# Altium project Smart_Garden.PrjPCB
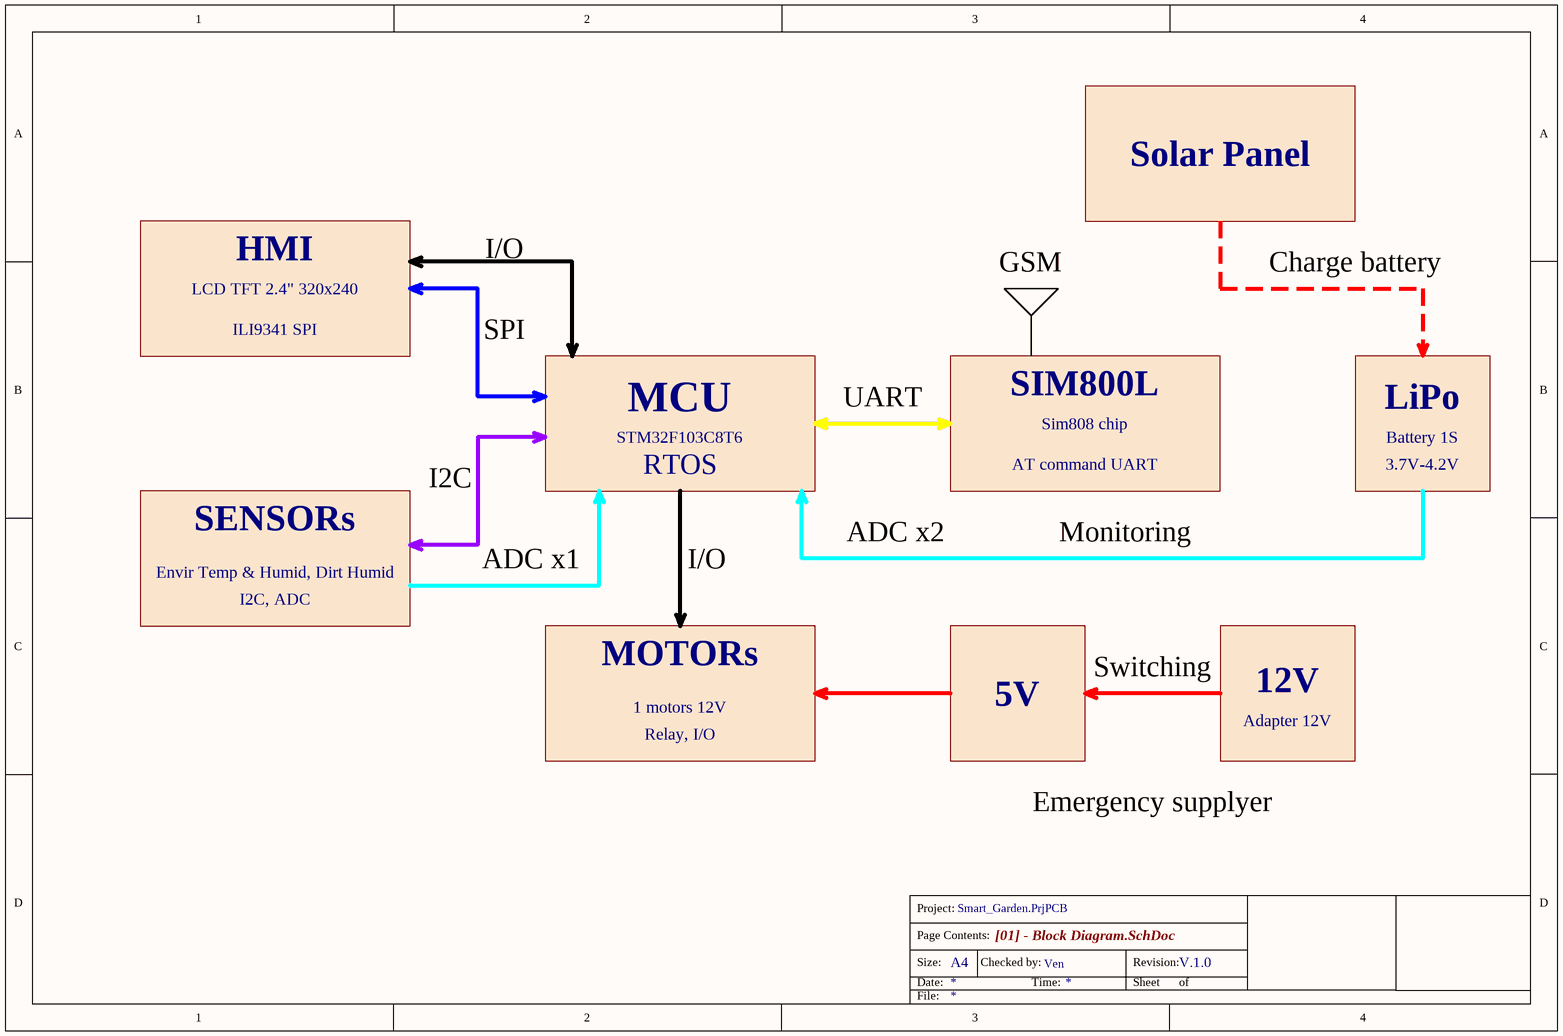
[diagram p0: [01] - Block Diagram.SchDoc]
9 sheets, 81 parts. Net scope: hierarchical (ports join the sheet entries above them; power ports are global).
Board files: Smart_Garden.PcbDoc, LOGO.PcbDoc
Sheets:
  [01] - Block Diagram.SchDoc
  [02] - Sheet Connector.SchDoc
    01 = [03] - MCU.SchDoc
    02 = [04] - SIM808.SchDoc
    04 = [06] - Sensor.SchDoc
    03 = [05] - HMI.SchDoc
    06 = [08] - Solar.SchDoc
    07 = [09] - Power.SchDoc
    05 = [07] - Motor.SchDoc

## Sheet [01] - Block Diagram.SchDoc: =ProjectName
size A4; CheckedBy: Ven; Author: Ven; CompanyName: HUST; Revision: V.1.0

### Notes on the sheet
- Solar Panel
- HMI
- I/O
- LCD TFT 2.4" 320x240
- GSM
- Charge battery
- ILI9341 SPI
- SPI
- SIM800L
- MCU
- STM32F103C8T6
- UART
- Sim808 chip
- LiPo
- Battery 1S
- SENSORs
- I2C
- RTOS
- AT command UART
- 3.7V-4.2V
- Envir Temp & Humid, Dirt Humid
- ADC x1
- ADC x2
- Monitoring
- I2C, ADC
- MOTORs
- 1 motors 12V
- 5V
- Switching
- 12V
- Adapter 12V
- Relay, I/O
- Emergency supplyer
- Project:
- Page Contents:
- Size:
- Date:
- A4
- Checked by:
- Time:
- Revision:
- Sheet
- of
- File:

## Sheet [02] - Sheet Connector.SchDoc: =ProjectName
size A4; CheckedBy: Ven; Author: Ven; CompanyName: HUST; Revision: V.1.0
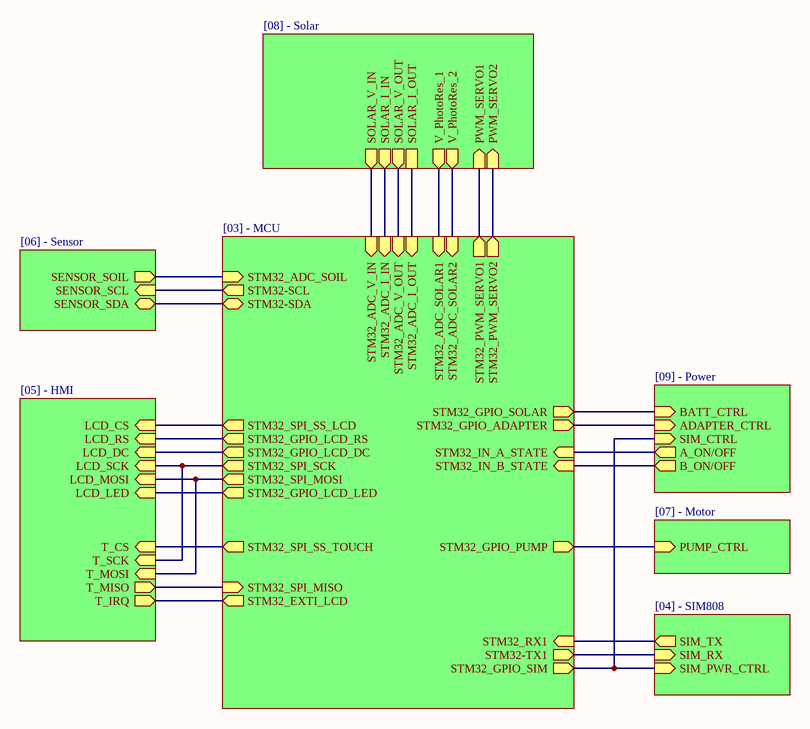
[diagram p1: [02] - Sheet Connector.SchDoc]

### Sub-sheets
01 = [03] - MCU: STM32-SDA (bidir), STM32_GPIO_SOLAR (out), STM32_SPI_MISO (in), STM32_EXTI_LCD (out), STM32_ADC_SOLAR1 (in), STM32_ADC_SOIL (in), STM32_GPIO_LCD_LED (out), STM32_SPI_SS_TOUCH (out), STM32_IN_B_STATE (in), STM32_ADC_I_IN (in), STM32_GPIO_PUMP (out), STM32_ADC_V_IN (in), STM32_ADC_SOLAR2 (in), STM32_GPIO_LCD_RS (out), STM32-TX1 (out), STM32_GPIO_LCD_DC (out), STM32_GPIO_ADAPTER (out), STM32_ADC_I_OUT (in), STM32_SPI_SS_LCD (out), STM32_RX1 (in), STM32_IN_A_STATE (in), STM32_SPI_MOSI (out), STM32_SPI_SCK (out), STM32-SCL (out), STM32_ADC_V_OUT (in), STM32_PWM_SERVO2 (out), STM32_PWM_SERVO1 (out), STM32_GPIO_SIM (out)
02 = [04] - SIM808: SIM_TX (out), SIM_RX (in), SIM_PWR_CTRL (in)
03 = [05] - HMI: T_SCK (in), LCD_MOSI (in), LCD_DC (in), T_MOSI (in), T_IRQ (out), T_MISO (out), LCD_LED (in), LCD_SCK (in), LCD_CS (in), T_CS (in), LCD_RS (in)
04 = [06] - Sensor: SENSOR_SCL (in), SENSOR_SDA (bidir), SENSOR_SOIL (out)
05 = [07] - Motor: PUMP_CTRL (in)
06 = [08] - Solar: SOLAR_V_OUT (out), SOLAR_I_OUT, SOLAR_V_IN (out), SOLAR_I_IN (out), PWM_SERVO2 (in), PWM_SERVO1 (in), V_PhotoRes_1 (out), V_PhotoRes_2 (out)
07 = [09] - Power: A_ON/OFF (out), BATT_CTRL (in), SIM_CTRL (in), ADAPTER_CTRL (in), B_ON/OFF (out)

### Nets
5V-1: sheet 01/STM32_IN_A_STATE, sheet 07/A_ON/OFF
CTRL: sheet 01/STM32_GPIO_SIM, sheet 02/SIM_PWR_CTRL, sheet 07/SIM_CTRL
RX1: sheet 01/STM32_RX1, sheet 02/SIM_TX
SCL: sheet 01/STM32-SCL, sheet 04/SENSOR_SCL
SDA: sheet 01/STM32-SDA, sheet 04/SENSOR_SDA
TX1: sheet 01/STM32-TX1, sheet 02/SIM_RX
NetIC2_7: sheet 01/STM32_ADC_I_IN, sheet 06/SOLAR_I_IN
NetIC3_7: sheet 01/STM32_ADC_I_OUT, sheet 06/SOLAR_I_OUT
NetJP1_1: sheet 01/STM32_GPIO_LCD_LED, sheet 03/LCD_LED
NetJP1_2: sheet 01/STM32_SPI_SCK, sheet 03/T_SCK, sheet 03/LCD_SCK
NetJP1_3: sheet 01/STM32_SPI_MOSI, sheet 03/LCD_MOSI, sheet 03/T_MOSI
NetJP1_4: sheet 01/STM32_GPIO_LCD_DC, sheet 03/LCD_DC
NetJP1_5: sheet 01/STM32_GPIO_LCD_RS, sheet 03/LCD_RS
NetJP1_6: sheet 01/STM32_SPI_SS_LCD, sheet 03/LCD_CS
NetJP2_1: sheet 01/STM32_EXTI_LCD, sheet 03/T_IRQ
NetJP2_2: sheet 01/STM32_SPI_MISO, sheet 03/T_MISO
NetJP2_4: sheet 01/STM32_SPI_SS_TOUCH, sheet 03/T_CS
NetJP4_2: sheet 01/STM32_ADC_SOIL, sheet 04/SENSOR_SOIL
NetJP5_2: sheet 01/STM32_PWM_SERVO2, sheet 06/PWM_SERVO2
NetJP5_3: sheet 01/STM32_PWM_SERVO1, sheet 06/PWM_SERVO1
NetJP6_2: sheet 01/STM32_ADC_SOLAR2, sheet 06/V_PhotoRes_2
NetJP6_4: sheet 01/STM32_ADC_SOLAR1, sheet 06/V_PhotoRes_1
NetQ4_1: sheet 01/STM32_GPIO_ADAPTER, sheet 07/ADAPTER_CTRL
NetQ6_1: sheet 01/STM32_GPIO_SOLAR, sheet 07/BATT_CTRL
NetQ6_3: sheet 01/STM32_IN_B_STATE, sheet 07/B_ON/OFF
NetR2_1: sheet 01/STM32_GPIO_PUMP, sheet 05/PUMP_CTRL
NetR6_1: sheet 01/STM32_ADC_V_IN, sheet 06/SOLAR_V_IN
NetR7_1: sheet 01/STM32_ADC_V_OUT, sheet 06/SOLAR_V_OUT

### Notes on the sheet
- Project:
- Page Contents:
- Size:
- Date:
- A4
- Checked by:
- Time:
- Revision:
- Sheet
- of
- File:

## Sheet [03] - MCU.SchDoc: =ProjectName
size A4; CheckedBy: Ven; Author: Ven; CompanyName: HUST; Revision: V.1.0
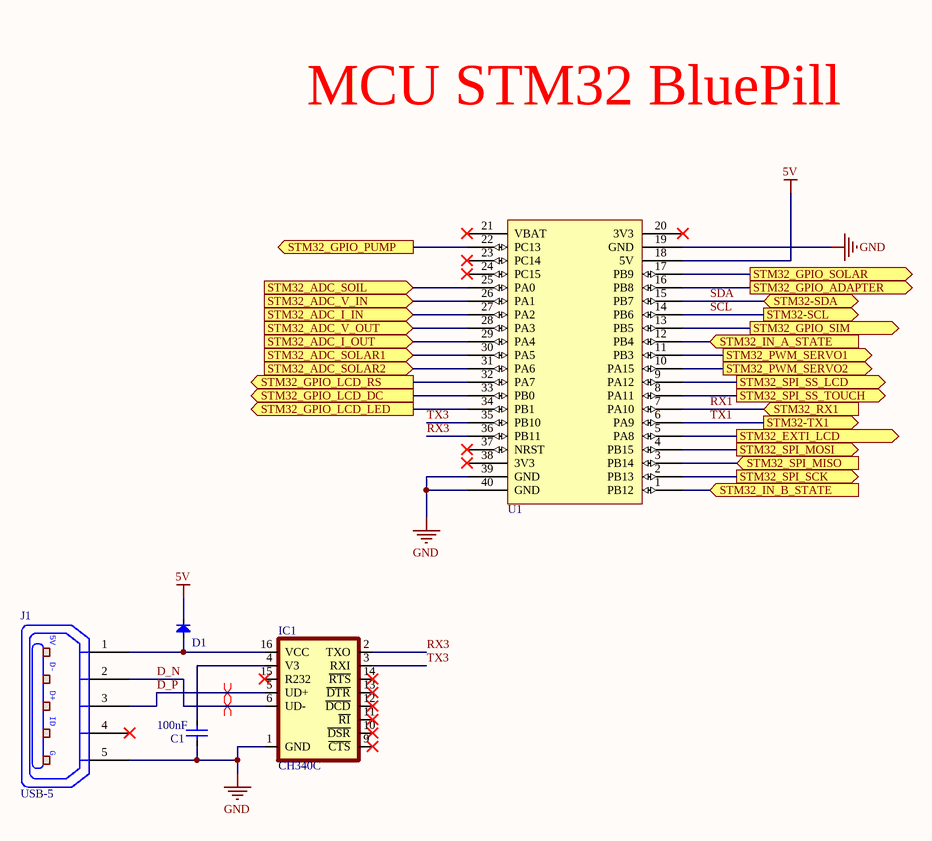
[diagram p2: [03] - MCU.SchDoc]

### Parts
C1  100nF  [CAP_0805]
D1  SS34  [DO-214AC(SMA)]  (value not drawn)
IC1  CH340C  [SO016]
J1  USB-5  [USB-M1]
U1  STM32 BluePill  [STM32 Bluepill]  (value not drawn)

### Ports
STM32-SCL (out), STM32-SDA (bidir), STM32-TX1 (out), STM32_ADC_I_IN (in), STM32_ADC_I_OUT (in), STM32_ADC_SOIL (in), STM32_ADC_SOLAR1 (in), STM32_ADC_SOLAR2 (in), STM32_ADC_V_IN (in), STM32_ADC_V_OUT (in), STM32_EXTI_LCD (out), STM32_GPIO_ADAPTER (out), STM32_GPIO_LCD_DC (out), STM32_GPIO_LCD_LED (out), STM32_GPIO_LCD_RS (out), STM32_GPIO_PUMP (out), STM32_GPIO_SIM (out), STM32_GPIO_SOLAR (out), STM32_IN_A_STATE (in), STM32_IN_B_STATE (in), STM32_PWM_SERVO1 (out), STM32_PWM_SERVO2 (out), STM32_RX1 (in), STM32_SPI_MISO (in), STM32_SPI_MOSI (out), STM32_SPI_SCK (out), STM32_SPI_SS_LCD (out), STM32_SPI_SS_TOUCH (out)

### Nets
5V: D1.2(K) U1.18(5V)
5V-1: U1.12(PB4) ; port STM32_IN_A_STATE
GND: C1.1 IC1.1(GND) J1.5(P5) U1.19(GND) U1.39(GND) U1.40(GND)
CTRL: U1.13(PB5) ; port STM32_GPIO_SIM
D_N: IC1.6(UD-) J1.2(P2)
D_P: IC1.5(UD+) J1.3(P3)
RX1: U1.7(PA10) ; port STM32_RX1
RX3: IC1.2(TXO) U1.36(PB11)
SCL: U1.14(PB6) ; port STM32-SCL
SDA: U1.15(PB7) ; port STM32-SDA
TX1: U1.6(PA9) ; port STM32-TX1
TX3: IC1.3(RXI) U1.35(PB10)
NetC1_2: C1.2 IC1.4(V3)
NetD1_1: D1.1(A) IC1.16(VCC) J1.1(P1)
NetIC2_7: U1.27(PA2) ; port STM32_ADC_I_IN
NetIC3_7: U1.29(PA4) ; port STM32_ADC_I_OUT
NetJP1_1: U1.34(PB1) ; port STM32_GPIO_LCD_LED
NetJP1_2: U1.2(PB13) ; port STM32_SPI_SCK
NetJP1_3: U1.4(PB15) ; port STM32_SPI_MOSI
NetJP1_4: U1.33(PB0) ; port STM32_GPIO_LCD_DC
NetJP1_5: U1.32(PA7) ; port STM32_GPIO_LCD_RS
NetJP1_6: U1.9(PA12) ; port STM32_SPI_SS_LCD
NetJP2_1: U1.5(PA8) ; port STM32_EXTI_LCD
NetJP2_2: U1.3(PB14) ; port STM32_SPI_MISO
NetJP2_4: U1.8(PA11) ; port STM32_SPI_SS_TOUCH
NetJP4_2: U1.25(PA0) ; port STM32_ADC_SOIL
NetJP5_2: U1.10(PA15) ; port STM32_PWM_SERVO2
NetJP5_3: U1.11(PB3) ; port STM32_PWM_SERVO1
NetJP6_2: U1.31(PA6) ; port STM32_ADC_SOLAR2
NetJP6_4: U1.30(PA5) ; port STM32_ADC_SOLAR1
NetQ4_1: U1.16(PB8) ; port STM32_GPIO_ADAPTER
NetQ6_1: U1.17(PB9) ; port STM32_GPIO_SOLAR
NetQ6_3: U1.1(PB12) ; port STM32_IN_B_STATE
NetR2_1: U1.22(PC13) ; port STM32_GPIO_PUMP
NetR6_1: U1.26(PA1) ; port STM32_ADC_V_IN
NetR7_1: U1.28(PA3) ; port STM32_ADC_V_OUT

Not connected (* = marked no-connect by the designer): IC1 9(~{CTS})* 10(~{DSR})* 11(~{RI})* 12(~{DCD})* 13(~{DTR})* 14(~{RTS})* 15(R232)*; J1 4(P4)*; U1 20(3V3)* 21(VBAT)* 23(PC14)* 24(PC15)* 37(NRST)* 38(3V3)*

### Layout directives
differential pair: D_N, D_P

### Notes on the sheet
- MCU STM32 BluePill
- Project:
- Page Contents:
- Size:
- Date:
- A4
- Checked by:
- Time:
- Revision:
- Sheet
- of
- File:
- (in symbol USB-5) 5V; D-; D+; ID; G

### Library data of the parts
C1 = CapSMD: Capacitor; Value: 33p; Published: 8-Jun-2000; LatestRevisionDate: 17-Jul-2002; LatestRevisionNote: Re-released for DXP Platform.; PackageReference: RAD-0.3; Publisher: Altium Limited
D1 = Diode SMD: Diode Schottky 1N5822 3A 40V SMA; Code - JEDEC: DO-214-AB; Value: 1N5007; Published: 8-Jun-2000; Revision: July-2002: Re-released for DXP Platform.; Publisher: Altium Limited
IC1 = CH340C: USB to serial chip CH340; MF: WCH; Package: Package; Check_prices: https://www.snapeda.com/parts/CH340C/WCH/view-part/5428851/?ref=eda; Value: *; Price: None; MP: CH340C; Availability: Unavailable; SnapEDA_Link: https://www.snapeda.com/parts/CH340C/WCH/view-part/5428851/?ref=snap
J1 = USB-5: Manufacturer: FCI; Manufacturer Part Number: 10118193-0001LF; Connector Type: USB - micro B; Number of Contacts: 5; Gender: Receptacle; Specifications: USB 2.0; .Creator: MM; .Checked PCB: RF; Supplier 1: Digi-Key; RoHS: RoHS Compliant; Category: Connectors, Interconnects; Stock 1: 28642; Pricing 1: 1=0.46, 10=0.433, 25=0.3712, 50=0.3156, 100=0.3032, 250=0.27224, 500=0.25988 (USD); Packaging: Cut Tape (CT); Mounting Type: Surface Mount, Right Angle, Horizontal; Features: Shielded, Solder Retention; Ingress Protection: -; ComponentLink1URL: http://portal.fciconnect.com/Comergent//fci/drawing/10118193.pdf; ComponentLink1Description: http://portal.fciconnect.com/Comergent//fci/drawing/10118193.pdf; Supplier Part Number 1: 609-4616-1-ND; .Checked SCH: MM

## Sheet [04] - SIM808.SchDoc: =ProjectName
size A4; CheckedBy: Ven; Author: Ven; CompanyName: HUST; Revision: V.1.0
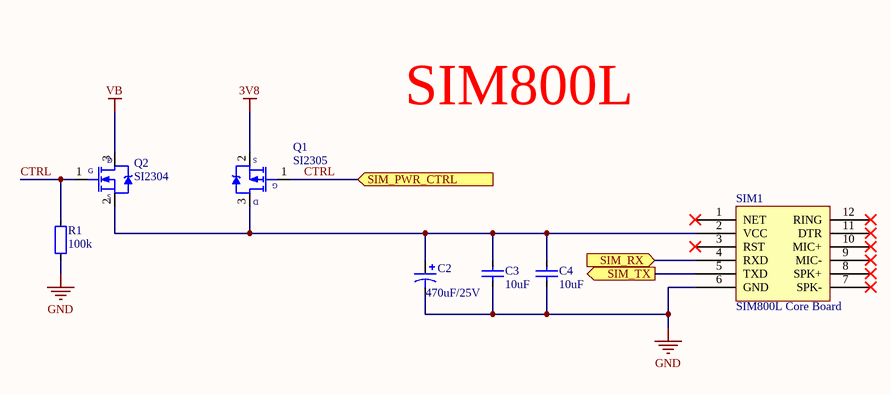
[diagram p3: [04] - SIM808.SchDoc]

### Parts
C2  470uF/25V  [C8mm]
C3  10uF  [CAP_0805]
C4  10uF  [CAP_0805]
Q1  SI2305  [SOT23]
Q2  SI2304  [SOT23]
R1  100k  [RES-SMD-0805]
SIM1  SIM800L Core Board  [SIM800L Core Board]

### Ports
SIM_PWR_CTRL (in), SIM_RX (in), SIM_TX (out)

### Nets
3V8: Q1.2(S)
GND: C2.2 C3.1 C4.1 R1.1 SIM1.6(GND)
VB: Q2.3(D)
CTRL: Q1.1(G) Q2.1(G) R1.2 ; port SIM_PWR_CTRL
RX1: SIM1.5(TXD) ; port SIM_TX
TX1: SIM1.4(RXD) ; port SIM_RX
NetC2_1: C2.1 C3.2 C4.2 Q1.3(D) Q2.2(S) SIM1.2(VCC)

Not connected (* = marked no-connect by the designer): SIM1 1(NET)* 3(RST)* 7(SPK-)* 8(SPK+)* 9(MIC-)* 10(MIC+)* 11(DTR)* 12(RING)*

### Notes on the sheet
- SIM800L
- Project:
- Page Contents:
- Size:
- Date:
- A4
- Checked by:
- Time:
- Revision:
- Sheet
- of
- File:

### Library data of the parts
C2 = Cap Pol: Polarized Capacitor (Axial); Published: 8-Jun-2000; LatestRevisionDate: 17-Jul-2002; LatestRevisionNote: Re-released for DXP Platform.; PackageReference: POLAR0.8; Publisher: Altium Limited
C3 C4 = CapSMD: Capacitor; Value: 33p; Published: 8-Jun-2000; LatestRevisionDate: 17-Jul-2002; LatestRevisionNote: Re-released for DXP Platform.; PackageReference: RAD-0.3; Publisher: Altium Limited
Q1 = SI2305: SI2305 A5SHB P-MOSFET 3.5A 8V SOT-23
Q2 = SI2304: SI2304 A4SHB N-MOSFET 3.6A 30V SOT-23
R1 = Resistor - SMD: Resistor; Manufacturer: Generic Components; Class: Passive; Published: 08/06/2000; Publisher: Altium Hobart Technology Centre

## Sheet [06] - Sensor.SchDoc: =ProjectName
size A4; CheckedBy: Ven; Author: Ven; CompanyName: HUST; Revision: V.1.0
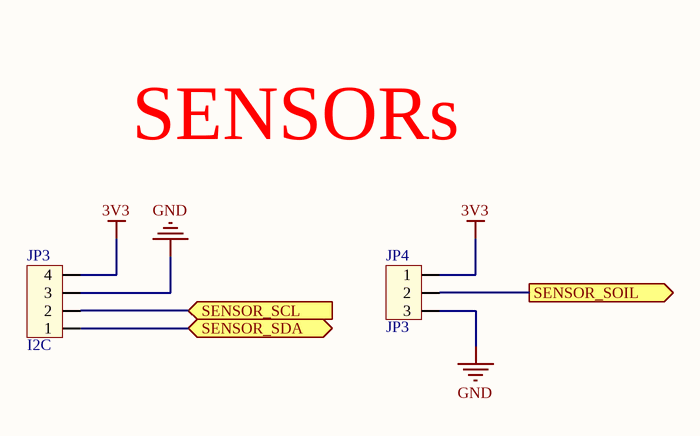
[diagram p4: [06] - Sensor.SchDoc]

### Parts
JP3  I2C  [CON4]
JP4  JP3  [CON3]

### Ports
SENSOR_SCL (in), SENSOR_SDA (bidir), SENSOR_SOIL (out)

### Nets
3V3: JP3.4 JP4.1
GND: JP3.3 JP4.3
SCL: JP3.2 ; port SENSOR_SCL
SDA: JP3.1 ; port SENSOR_SDA
NetJP4_2: JP4.2 ; port SENSOR_SOIL

### Notes on the sheet
- SENSORs
- Project:
- Page Contents:
- Size:
- Date:
- A4
- Checked by:
- Time:
- Revision:
- Sheet
- of
- File:

### Library data of the parts
JP3 = Con4: Connector 4; Value: Connector 4
JP4 = Con3: Connector 3; Value: Connector 3

## Sheet [05] - HMI.SchDoc: =ProjectName
size A4; CheckedBy: Ven; Author: Ven; CompanyName: HUST; Revision: V.1.0
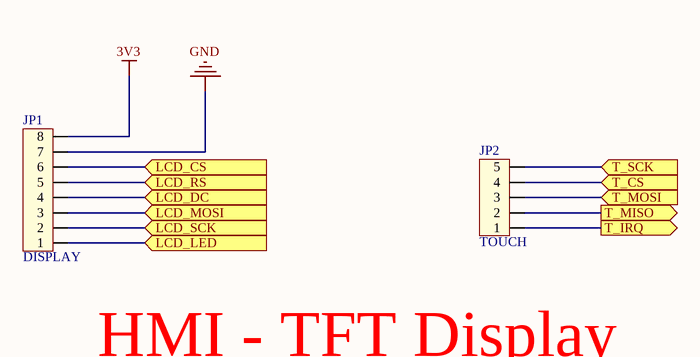
[diagram p5: [05] - HMI.SchDoc]

### Parts
JP1  DISPLAY  [CON8]
JP2  TOUCH  [CON5]

### Ports
LCD_CS (in), LCD_DC (in), LCD_LED (in), LCD_MOSI (in), LCD_RS (in), LCD_SCK (in), T_CS (in), T_IRQ (out), T_MISO (out), T_MOSI (in), T_SCK (in)

### Nets
3V3: JP1.8
GND: JP1.7
NetJP1_1: JP1.1 ; port LCD_LED
NetJP1_2: JP1.2 JP2.5 ; port LCD_SCK, port T_SCK
NetJP1_3: JP1.3 JP2.3 ; port LCD_MOSI, port T_MOSI
NetJP1_4: JP1.4 ; port LCD_DC
NetJP1_5: JP1.5 ; port LCD_RS
NetJP1_6: JP1.6 ; port LCD_CS
NetJP2_1: JP2.1 ; port T_IRQ
NetJP2_2: JP2.2 ; port T_MISO
NetJP2_4: JP2.4 ; port T_CS

### Notes on the sheet
- HMI - TFT Display
- Project:
- Page Contents:
- Size:
- Date:
- A4
- Checked by:
- Time:
- Revision:
- Sheet
- of
- File:

### Library data of the parts
JP1 = Con8: Connector 8; Value: Connector 8
JP2 = Con5: Connector 5; Value: Connector 5

## Sheet [08] - Solar.SchDoc: =ProjectName
size A4; CheckedBy: Ven; Author: Ven; CompanyName: HUST; Revision: V.1.0
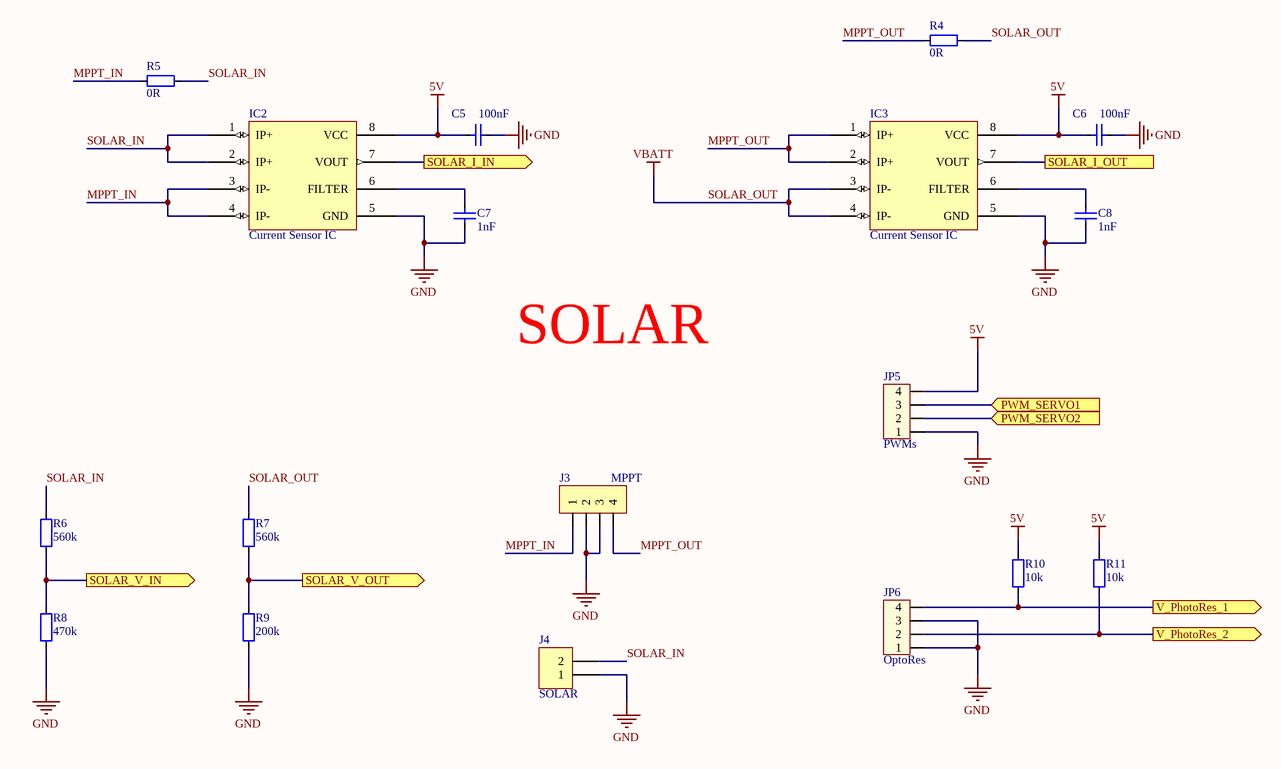
[diagram p6: [08] - Solar.SchDoc]

### Parts
C5  100nF  [CAP_0805]
C6  100nF  [CAP_0805]
C7  1nF  [CAP_0805]
C8  1nF  [CAP_0805]
IC2  Current Sensor IC  [SOIC-8]
IC3  Current Sensor IC  [SOIC-8]
J3  MPPT  [JP4-C1T]
J4  SOLAR  [KF2-5.08]
JP5  PWMs  [CON4]
JP6  OptoRes  [CON4]
R4  0R  [RES-SMD-0805]
R5  0R  [RES-SMD-0805]
R6  560k  [RES-SMD-0805]
R7  560k  [RES-SMD-0805]
R8  470k  [RES-SMD-0805]
R9  200k  [RES-SMD-0805]
R10  10k  [RES-SMD-0805]
R11  10k  [RES-SMD-0805]

### Ports
PWM_SERVO1 (in), PWM_SERVO2 (in), SOLAR_I_IN (out), SOLAR_I_OUT, SOLAR_V_IN (out), SOLAR_V_OUT (out), V_PhotoRes_1 (out), V_PhotoRes_2 (out)

### Nets
5V: C5.2 C6.2 IC2.8(VCC) IC3.8(VCC) JP5.4 R10.2 R11.2
GND: C5.1 C6.1 C7.1 C8.1 IC2.5(GND) IC3.5(GND) J3.2 J3.3 J4.1 JP5.1 JP6.1 JP6.3 R8.1 R9.1
SOLAR_OUT: IC3.3(IP-) IC3.4(IP-) R4.1 R7.2  [also labelled VBATT]
MPPT_IN: IC2.3(IP-) IC2.4(IP-) J3.1 R5.2
MPPT_OUT: IC3.1(IP+) IC3.2(IP+) J3.4 R4.2
SOLAR_IN: IC2.1(IP+) IC2.2(IP+) J4.2 R5.1 R6.2
NetC7_2: C7.2 IC2.6(FILTER)
NetC8_2: C8.2 IC3.6(FILTER)
NetIC2_7: IC2.7(VOUT) ; port SOLAR_I_IN
NetIC3_7: IC3.7(VOUT) ; port SOLAR_I_OUT
NetJP5_2: JP5.2 ; port PWM_SERVO2
NetJP5_3: JP5.3 ; port PWM_SERVO1
NetJP6_2: JP6.2 R11.1 ; port V_PhotoRes_2
NetJP6_4: JP6.4 R10.1 ; port V_PhotoRes_1
NetR6_1: R6.1 R8.2 ; port SOLAR_V_IN
NetR7_1: R7.1 R9.2 ; port SOLAR_V_OUT

### Notes on the sheet
- SOLAR
- Project:
- Page Contents:
- Size:
- Date:
- A4
- Checked by:
- Time:
- Revision:
- Sheet
- of
- File:

### Library data of the parts
C5-C8 = CapSMD: Capacitor; Value: 33p; Published: 8-Jun-2000; LatestRevisionDate: 17-Jul-2002; LatestRevisionNote: Re-released for DXP Platform.; PackageReference: RAD-0.3; Publisher: Altium Limited
IC2 IC3 = ACS712
J3 = JP4: WR-PHD 2.54 mm Angled Socket Header; Manufacturer: W¨¹rth Elektronik eiSos GmbH; partNo: 613004143121; ComponentLink1 Description: Manufacturer; ComponentLink2 Description: Datasheet; NoPins: 04; Created Date: 29 March 2013; ComponentLink1URL: http://www.we-online.com; ComponentLink2URL: http://katalog.we-online.de/em/datasheet/6130xx143121.pdf; Created by: Karrer Zheng
J4 = KF2: Manufacturer: Würth Elektronik eiSos GmbH; partNo: 691103110002; ComponentLink1 Description: Manufacturer; ComponentLink2 Description: Datasheet; NoPins: 2; Created Date: 29 October 2013; ComponentLink1URL: http://www.we-online.com; ComponentLink2URL: http://katalog.we-online.de/em/datasheet/6911031100xx.pdf; Created by: Karrer Zheng
JP5 JP6 = Con4: Connector 4; Value: Connector 4
R4-R11 = Resistor - SMD: as R1 on sheet [04] - SIM808; Published: 08/06/2000; Publisher: Altium Hobart Technology Centre

## Sheet [09] - Power.SchDoc: =ProjectName
size A4; CheckedBy: Ven; Author: Ven; CompanyName: HUST; Revision: V.1.0
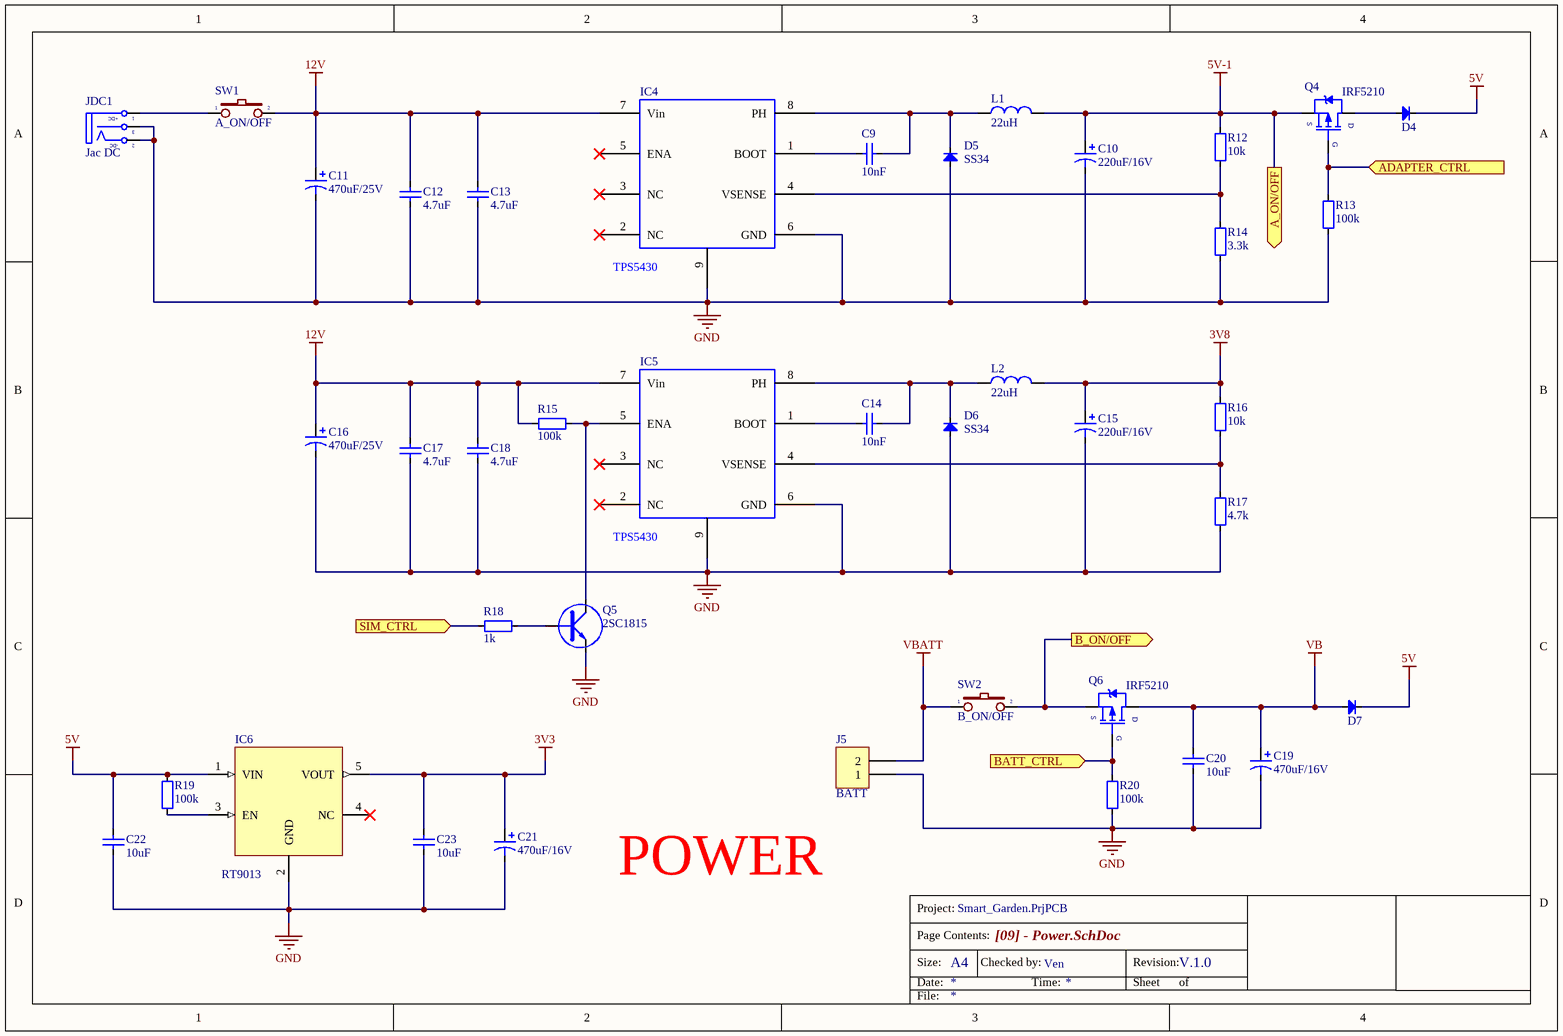
[diagram p7: [09] - Power.SchDoc]

### Parts
C9  10nF  [CAP_0805]
C10  220uF/16V  [C8mm]
C11  470uF/25V  [C8mm]
C12  4.7uF  [CAP_0805]
C13  4.7uF  [CAP_0805]
C14  10nF  [CAP_0805]
C15  220uF/16V  [C8mm]
C16  470uF/25V  [C8mm]
C17  4.7uF  [CAP_0805]
C18  4.7uF  [CAP_0805]
C19  470uF/16V  [C8mm]
C20  10uF  [CAP_0805]
C21  470uF/16V  [C8mm]
C22  10uF  [CAP_0805]
C23  10uF  [CAP_0805]
D4  SS34  [DO-214AC(SMA)]  (value not drawn)
D5  SS34  [DO-214AC(SMA)]
D6  SS34  [DO-214AC(SMA)]
D7  SS34  [DO-214AC(SMA)]  (value not drawn)
IC4  TPS5430  [TPS5430-2]
IC5  TPS5430  [TPS5430-2]
IC6  RT9013  [SOT23-5]
J5  BATT  [KF2-5.08]
JDC1  Jac DC  [DC-IN]
L1  22uH  [L-SMD-M-7.3x4.5]
L2  22uH  [L-SMD-M-7.3x4.5]
Q4  IRF5210  [TO-220]
Q5  2SC1815  [SOT23]
Q6  IRF5210  [TO-220]
R12  10k  [RES-SMD-0805]
R13  100k  [RES-SMD-0805]
R14  3.3k  [RES-SMD-0805]
R15  100k  [RES-SMD-0805]
R16  10k  [RES-SMD-0805]
R17  4.7k  [RES-SMD-0805]
R18  1k  [RES-SMD-0805]
R19  100k  [RES-SMD-0805]
R20  100k  [RES-SMD-0805]
SW1  A_ON/OFF  [SW2]
SW2  B_ON/OFF  [SW2]

### Ports
A_ON/OFF (out), ADAPTER_CTRL (in), B_ON/OFF (out), BATT_CTRL (in), SIM_CTRL (in)

### Nets
3V3: C21.1 C23.2 IC6.5(VOUT)
3V8: C15.1 L2.2 R16.2
5V: C22.2 D4.2(K) D7.2(K) IC6.1(VIN) R19.1
5V-1: C10.1 L1.2 Q4.3(S) R12.2 ; port A_ON/OFF
12V: C11.1 C12.2 C13.2 C16.1 C17.2 C18.2 IC4.7(Vin) IC5.7(Vin) R15.1 SW1.2
GND: C10.2 C11.2 C12.1 C13.1 C15.2 C16.2 C17.1 C18.1 C19.2 C20.1 C21.2 C22.1 C23.1 D5.1(A) D6.1(A) IC4.6(GND) IC4.9(PWR_PAD) IC5.6(GND) IC5.9(PWR_PAD) IC6.2(GND) J5.1 JDC1.2(TN) JDC1.3(S) Q5.3(E) R13.1 R14.1 R17.1 R20.2
VB: C19.1 C20.2 D7.1(A) Q6.2(D)
VBATT: J5.2 SW2.1  [project net SOLAR_OUT]
CTRL: R18.1 ; port SIM_CTRL
NetC9_1: C9.1 D5.2(K) IC4.8(PH) L1.1
NetC9_2: C9.2 IC4.1(BOOT)
NetC14_1: C14.1 D6.2(K) IC5.8(PH) L2.1
NetC14_2: C14.2 IC5.1(BOOT)
NetD4_1: D4.1(A) Q4.2(D)
NetIC4_4: IC4.4(VSENSE) R12.1 R14.2
NetIC5_4: IC5.4(VSENSE) R16.1 R17.2
NetIC5_5: IC5.5(ENA) Q5.2(C) R15.2
NetIC6_3: IC6.3(EN) R19.2
NetJDC1_1: JDC1.1(T) SW1.1
NetQ4_1: Q4.1(G) R13.2 ; port ADAPTER_CTRL
NetQ5_1: Q5.1(B) R18.2
NetQ6_1: Q6.1(G) R20.1 ; port BATT_CTRL
NetQ6_3: Q6.3(S) SW2.2 ; port B_ON/OFF

Not connected (* = marked no-connect by the designer): IC4 2(NC)* 3(NC)* 5(ENA)*; IC5 2(NC)* 3(NC)*; IC6 4(NC)*

### Notes on the sheet
- POWER
- Project:
- Page Contents:
- Size:
- Date:
- A4
- Checked by:
- Time:
- Revision:
- Sheet
- of
- File:
- (in symbol DCIN) +DC; -DC

### Library data of the parts
C9 C12-C14 C17 C18 C20 C22 C23 = CapSMD: Capacitor; Value: 33p; Published: 8-Jun-2000; LatestRevisionDate: 17-Jul-2002; LatestRevisionNote: Re-released for DXP Platform.; PackageReference: RAD-0.3; Publisher: Altium Limited
C10 C11 C15 C16 C19 C21 = Cap Pol: Polarized Capacitor (Axial); Published: 8-Jun-2000; LatestRevisionDate: 17-Jul-2002; LatestRevisionNote: Re-released for DXP Platform.; PackageReference: POLAR0.8; Publisher: Altium Limited
D4-D7 = Diode SMD: as D1 on sheet [03] - MCU; Published: 8-Jun-2000; Revision: July-2002: Re-released for DXP Platform.; Publisher: Altium Limited
IC6 = RT9013: RT9013-33GB IC REG LINEAR 3.3V 500mA SOT23-5
J5 = KF2: as J4 on sheet [08] - Solar; Created Date: 29 October 2013; ComponentLink1URL: http://www.we-online.com; ComponentLink2URL: http://katalog.we-online.de/em/datasheet/6911031100xx.pdf; Created by: Karrer Zheng
JDC1 = DCIN: Jac DC input; Value: Jac DC
L1 L2 = Inductor: Value: 150 mH
Q4 Q6 = IRF5210: IR/Vishay P-Channel MOSFET 40A 100V
Q5 = 2SC1815: NPN 600mW, ECB; Value: C1815
R12-R20 = Resistor - SMD: as R1 on sheet [04] - SIM808; Published: 08/06/2000; Publisher: Altium Hobart Technology Centre
SW1 SW2 = SW2: Switch button 2 pin; Value: SW chip 2 pin
IC4 IC5 = TPS5430: Name: TPS5430

## Sheet [07] - Motor.SchDoc: =ProjectName
size A4; CheckedBy: Ven; Author: Ven; CompanyName: HUST; Revision: V.1.0
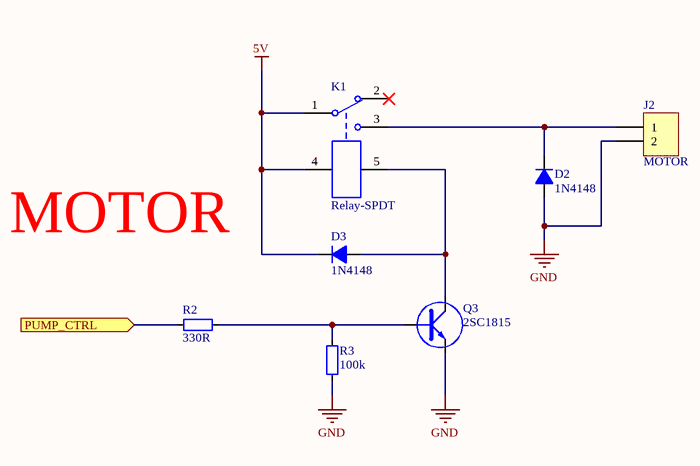
[diagram p8: [07] - Motor.SchDoc]

### Parts
D2  1N4148  [1N4148_SMD]
D3  1N4148  [1N4148_SMD]
J2  MOTOR  [KF2-5.08]
K1  Relay-SPDT  [RELAY5PIN-10A]
Q3  2SC1815  [SOT23]
R2  330R  [RES-SMD-0805]
R3  100k  [RES-SMD-0805]

### Ports
PUMP_CTRL (in)

### Nets
5V: D3.2(K) K1.1 K1.4
GND: D2.1(A) J2.2 Q3.3(E) R3.1
NetD2_2: D2.2(K) J2.1 K1.3
NetD3_1: D3.1(A) K1.5 Q3.2(C)
NetQ3_1: Q3.1(B) R2.2 R3.2
NetR2_1: R2.1 ; port PUMP_CTRL

Not connected (* = marked no-connect by the designer): K1 2*

### Notes on the sheet
- MOTOR
- Project:
- Page Contents:
- Size:
- Date:
- A4
- Checked by:
- Time:
- Revision:
- Sheet
- of
- File:

### Library data of the parts
D2 D3 = D1A: Diode 1A; Value: 1N4007
J2 = KF2: as J4 on sheet [08] - Solar; Created Date: 29 October 2013; ComponentLink1URL: http://www.we-online.com; ComponentLink2URL: http://katalog.we-online.de/em/datasheet/6911031100xx.pdf; Created by: Karrer Zheng
K1 = Relay-SPDT: Single-Pole Dual-Throw Relay; Published: 24-Mar-1999; LatestRevisionDate: 17-Jul-2002; LatestRevisionNote: Re-released for DXP Platform.; PackageReference: MODULE5B; Publisher: Altium Limited
Q3 = 2SC1815: NPN 600mW, ECB; Value: C1815
R2 R3 = Resistor - SMD: as R1 on sheet [04] - SIM808; Published: 08/06/2000; Publisher: Altium Hobart Technology Centre

## Nets that join several sheets
3V3: [06] - Sensor (JP3.4 JP4.1), [05] - HMI (JP1.8), [09] - Power (C21.1 C23.2 IC6.5)
3V8: [04] - SIM808 (Q1.2), [09] - Power (C15.1 L2.2 R16.2)
5V: [03] - MCU (D1.2 U1.18), [08] - Solar (7 pins), [09] - Power (5 pins), [07] - Motor (D3.2 K1.1 K1.4)
5V-1: [03] - MCU (U1.12), [09] - Power (C10.1 L1.2 Q4.3 R12.2)
GND: [03] - MCU (6 pins), [04] - SIM808 (5 pins), [06] - Sensor (JP3.3 JP4.3), [05] - HMI (JP1.7), [08] - Solar (14 pins), [09] - Power (28 pins), [07] - Motor (D2.1 J2.2 Q3.3 R3.1)
SOLAR_OUT: [08] - Solar (IC3.3 IC3.4 R4.1 R7.2), [09] - Power (J5.2 SW2.1)
VB: [04] - SIM808 (Q2.3), [09] - Power (C19.1 C20.2 D7.1 Q6.2)
CTRL: [03] - MCU (U1.13), [04] - SIM808 (Q1.1 Q2.1 R1.2), [09] - Power (R18.1)
NetIC2_7: [03] - MCU (U1.27), [08] - Solar (IC2.7)
NetIC3_7: [03] - MCU (U1.29), [08] - Solar (IC3.7)
NetJP1_1: [03] - MCU (U1.34), [05] - HMI (JP1.1)
NetJP1_2: [03] - MCU (U1.2), [05] - HMI (JP1.2 JP2.5)
NetJP1_3: [03] - MCU (U1.4), [05] - HMI (JP1.3 JP2.3)
NetJP1_4: [03] - MCU (U1.33), [05] - HMI (JP1.4)
NetJP1_5: [03] - MCU (U1.32), [05] - HMI (JP1.5)
NetJP1_6: [03] - MCU (U1.9), [05] - HMI (JP1.6)
NetJP2_1: [03] - MCU (U1.5), [05] - HMI (JP2.1)
NetJP2_2: [03] - MCU (U1.3), [05] - HMI (JP2.2)
NetJP2_4: [03] - MCU (U1.8), [05] - HMI (JP2.4)
NetJP4_2: [03] - MCU (U1.25), [06] - Sensor (JP4.2)
NetJP5_2: [03] - MCU (U1.10), [08] - Solar (JP5.2)
NetJP5_3: [03] - MCU (U1.11), [08] - Solar (JP5.3)
NetJP6_2: [03] - MCU (U1.31), [08] - Solar (JP6.2 R11.1)
NetJP6_4: [03] - MCU (U1.30), [08] - Solar (JP6.4 R10.1)
NetQ4_1: [03] - MCU (U1.16), [09] - Power (Q4.1 R13.2)
NetQ6_1: [03] - MCU (U1.17), [09] - Power (Q6.1 R20.1)
NetQ6_3: [03] - MCU (U1.1), [09] - Power (Q6.3 SW2.2)
NetR2_1: [03] - MCU (U1.22), [07] - Motor (R2.1)
NetR6_1: [03] - MCU (U1.26), [08] - Solar (R6.1 R8.2)
NetR7_1: [03] - MCU (U1.28), [08] - Solar (R7.1 R9.2)
RX1: [03] - MCU (U1.7), [04] - SIM808 (SIM1.5)
SCL: [03] - MCU (U1.14), [06] - Sensor (JP3.2)
SDA: [03] - MCU (U1.15), [06] - Sensor (JP3.1)
TX1: [03] - MCU (U1.6), [04] - SIM808 (SIM1.4)